# EAGLE schematic CONTROL circuit LED for Junction Box (EAGLE 9.6.2)
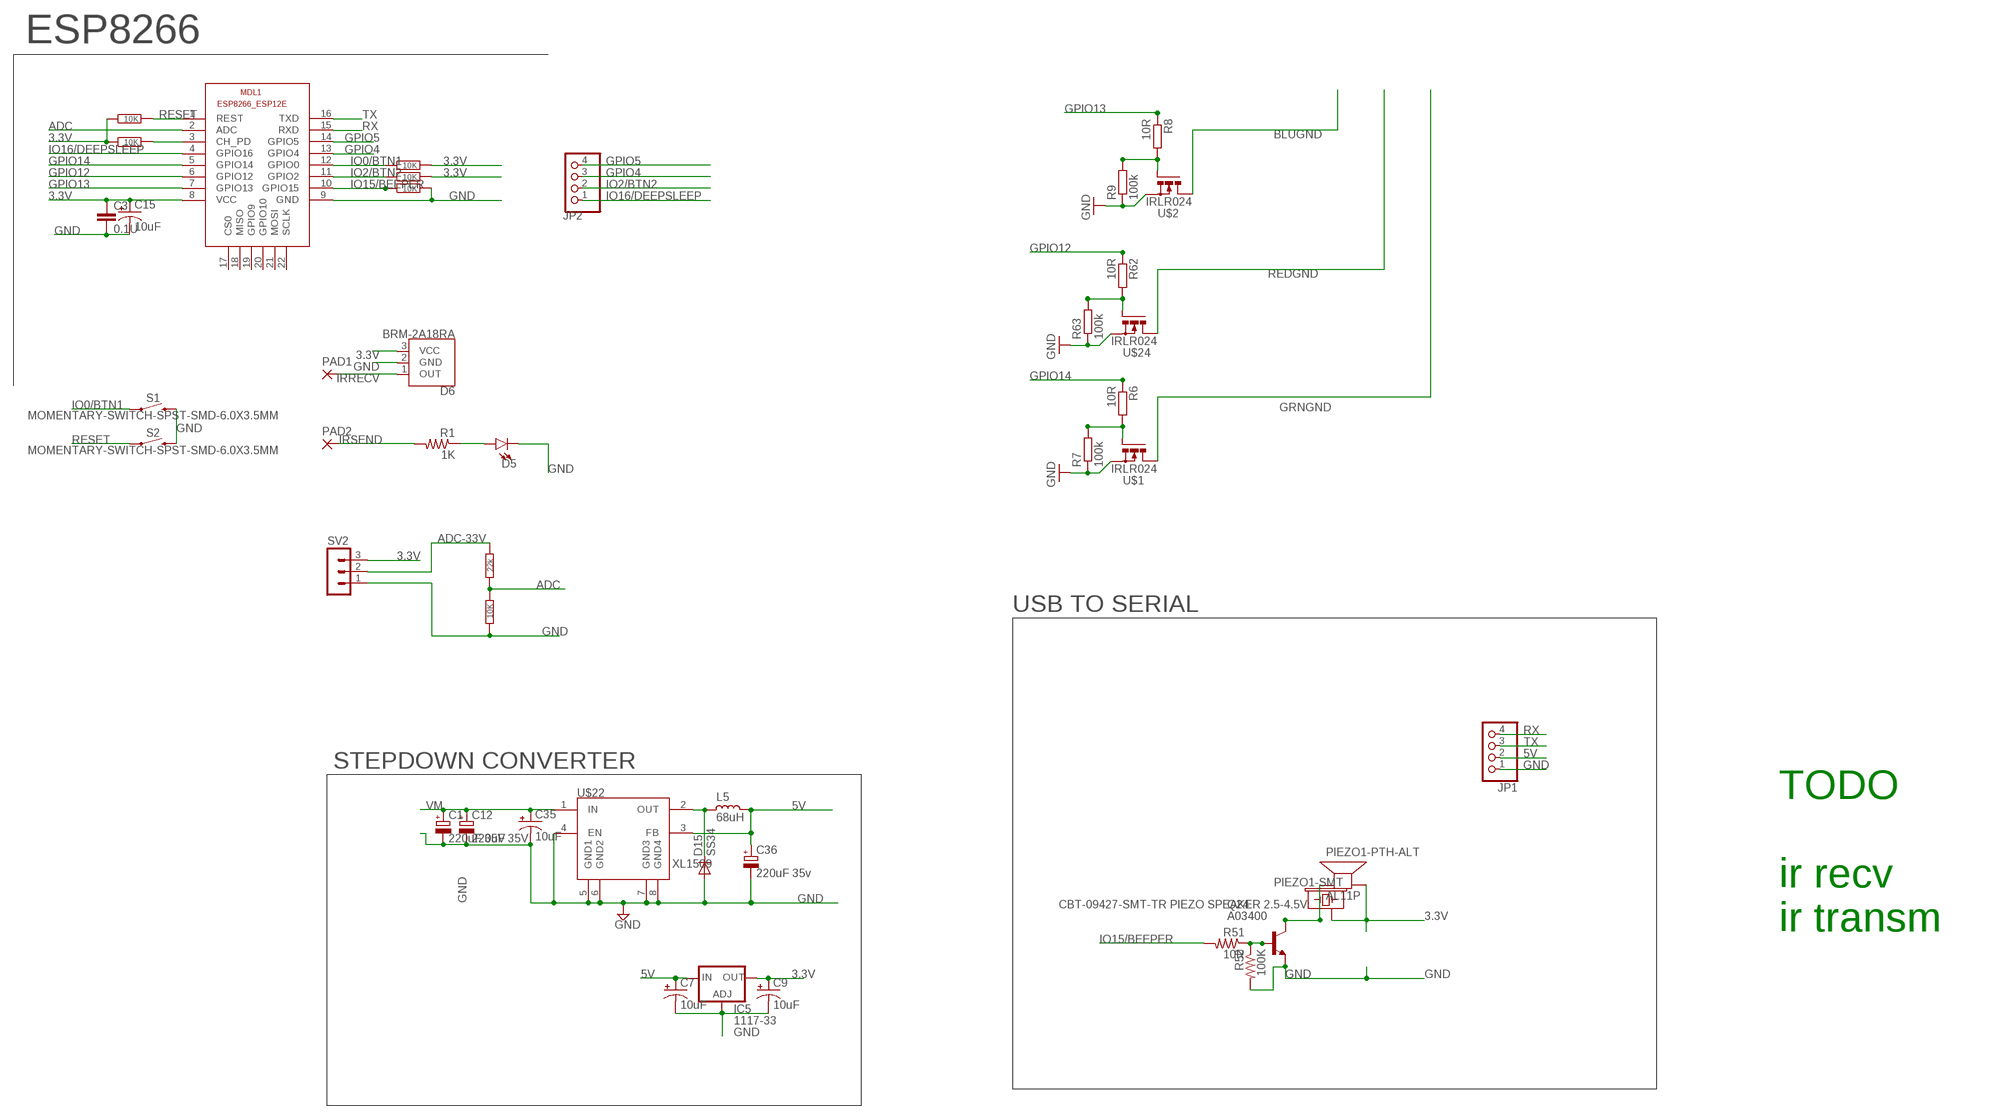
[diagram p0: schematic, sheet 1]

## Parts
C1  220uF 35V  CPOL-EUE3.5-8  [E3,5-8]
C3  0.1U  C-EUC1206  [C1206]
C7  10uF  CAP_POL1206  [EIA3216]
C9  10uF  CAP_POL1206  [EIA3216]
C12  220uF 35V  CPOL-EUE3.5-8  [E3,5-8]
C15  10uF  CAP_POL1206  [EIA3216]
C35  10uF  CAP_POL1206  [EIA3216]
C36  220uF 35v  CPOL-EUE3.5-8  [E3,5-8]
D5  LED3MM  [LED_3MM]
D6  BRM-2A18RA  [BRM-2508]
D15  SS34  DIODE-DO-214AC  [DO-214AC]
IC5  1117-33  LD117AS33TR  [SOT223]
JP1  PINHD-1X4  [1X04]
JP2  PINHD-1X4  [1X04]
L5  68uH  L_CD75  [CD75]
MDL1  ESP8266-12EESP8266-ESP12E  [ESP8266-ESP12E]
PAD1  1,6/0,9  [1,6/0,9]
PAD2  1,6/0,9  [1,6/0,9]
PIEZO1-PTH-ALT  AL11P  SPEAKER/AL11P  [AL11P]
PIEZO1-SMT  CBT-09427-SMT-TR PIEZO SPEAKER 2.5-4.5V  BUZZER-SMD  [BUZZER-CCV]
Q24  A03400  BC849SMD  [SOT23-BEC]
R1  1K  R-US_M1206  [M1206]
R3  22k  R-EU_R1206  [R1206]
R4  10K  R-EU_R1206  [R1206]
R6  10R  R-EU_R1206  [R1206]
R7  100k  R-EU_R1206  [R1206]
R8  10R  R-EU_R1206  [R1206]
R9  100k  R-EU_R1206  [R1206]
R11  10K  R-EU_R1206  [R1206]
R12  10K  R-EU_R1206  [R1206]
R28  10K  R-EU_R1206  [R1206]
R29  10K  R-EU_R1206  [R1206]
R31  10K  R-EU_R1206  [R1206]
R51  10R  R-US_R1206  [R1206]
R52  100K  R-US_R1206  [R1206]
R62  10R  R-EU_R1206  [R1206]
R63  100k  R-EU_R1206  [R1206]
S1  MOMENTARY-SWITCH-SPST-SMD-6.0X3.5MM  [TACTILE_SWITCH_SMD_6.0X3.5MM]
S2  MOMENTARY-SWITCH-SPST-SMD-6.0X3.5MM  [TACTILE_SWITCH_SMD_6.0X3.5MM]
SV2  MA03-1  [MA03-1]
U$1  IRLR024  N-POWER-MOSFETDPAK-MOSFET  [D-PAK_TO252AA]
U$2  IRLR024  N-POWER-MOSFETDPAK-MOSFET  [D-PAK_TO252AA]
U$22  XL1509  [SO08]
U$24  IRLR024  N-POWER-MOSFETDPAK-MOSFET  [D-PAK_TO252AA]

## Nets
3.3V: C3.1 C9.A(+) C15.A(+) D6.3(VCC) IC5.4(OUT) MDL1.8(VCC) PIEZO1-PTH-ALT.- PIEZO1-SMT.+ R11.2 R12.2 R28.1 R29.1 SV2.3
5V: C7.A(+) C36.+ IC5.3(IN) JP1.2 L5.1 U$22.3(FB)
ADC: MDL1.2(ADC) R3.1 R4.2
ADC-33V: R3.2 SV2.2
BEEPER-GND: PIEZO1-PTH-ALT.+ PIEZO1-SMT.- Q24.C
BLUGND: U$2.4(D)
GND: C1.- C3.2 C7.C(-) C9.C(-) C12.- C15.C(-) C35.C(-) C36.- D5.K(C) D6.2(GND) D15.2(A) IC5.1(ADJ) JP1.1 MDL1.9(GND) Q24.E R4.1 R7.1 R9.1 R31.2 R52.2 R63.1 S1.2 S2.2 SV2.1 U$1.3(S) U$2.3(S) U$22.4(EN) U$22.5(GND1) U$22.6(GND2) U$22.7(GND3) U$22.8(GND4) U$24.3(S)
GPIO4: JP2.3 MDL1.13(GPIO4)
GPIO5: JP2.4 MDL1.14(GPIO5)
GPIO12: MDL1.6(GPIO12) R62.1
GPIO13: MDL1.7(GPIO13) R8.1
GPIO14: MDL1.5(GPIO14) R6.1
GRNGND: U$1.4(D)
IO0/BTN1: MDL1.12(GPIO0) R12.1 S1.1
IO2/BTN2: JP2.2 MDL1.11(GPIO2) R11.1
IO15/BEEPER: MDL1.10(GPIO15) R31.1 R51.2
IO16/DEEPSLEEP: JP2.1 MDL1.4(GPIO16)
IRRECV: D6.1(OUT) PAD1.1(P)
IRSEND: PAD2.1(P) R1.2
N$3: R62.2 R63.2 U$24.1(G)
N$4: D15.1(C) L5.2 U$22.2(OUT)
N$5: R6.2 R7.2 U$1.1(G)
N$7: R8.2 R9.2 U$2.1(G)
N$13: D5.A R1.1
N$18: MDL1.3(CH_PD) R28.2
N$66: Q24.B R51.1 R52.1
REDGND: U$24.4(D)
RESET: MDL1.1(REST) R29.2 S2.1
RX: JP1.4 MDL1.15(RXD)
TX: JP1.3 MDL1.16(TXD)
VM: C1.+ C12.+ C35.A(+) U$22.1(IN)
Unconnected: MDL1.17(CS0) MDL1.18(MISO) MDL1.19(GPIO9) MDL1.20(GPIO10) MDL1.21(MOSI) MDL1.22(SCLK)

## Notes on the sheet
- ESP8266
- USB TO SERIAL
- STEPDOWN CONVERTER
- TODO
  
  ir recv
  ir transm

## Library data of the parts
C1 C12 C36 = rcl:CPOL-EU: POLARIZED CAPACITOR, European symbol
C3 = rcl:C-EU: CAPACITOR, European symbol
C7 C9 C15 C35 = SparkFun:CAP_POL: Capacitor Polarized These are standard SMD and PTH capacitors. Normally 10uF, 47uF, and 100uF in electrolytic and tantalum varieties. Always verify the external diameter of the through hole cap, it varies with capacity, voltage, and manufacturer. The EIA devices should be standard.
D5 = SparkFun-LED:LED: LED (Generic) Standard schematic elements and footprints for 5mm, 3mm, 1206, and 0603 sized LEDs. Generic LEDs with no color specified.; PROD_ID: DIO-08794
D6 = SparkFun-Sensors:BRM-2A18: BRM-2A18 IR Receiver The BRM-2A18 is miniaturized infrared receiver for remote control and other applications requiring improved ambient light rejection. Vertical package is a primary component on the ZX Distance and Gesture Sensor. RA package is not currently in-use. Example Datasheet <http://www.sinoskysun.com/upload/20110512/201105120447164615.PDF> SparkFun Products ZX Distance and Gesture Sensor <https://www.sparkfun.com/products/12780> (COM-12780)
D15 = dp_devices:DIODE: Various Diode Packages
IC5 = v-reg:LD117A?*: Low drop fixed and adjustable positive voltage regulators 1 A Source: http://www.st.com/stonline/products/literature/ds/7194/ld1117axx.pdf
JP1 JP2 = pinhead:PINHD-1X4: PIN HEADER
L5 = rc-master-smd:L_: INDUCTOR
MDL1 = ESP8266-ESP12E:ESP8266-12E: ESP8266-12E with additional I/O and GPIO04/05 corrected The author cannot warrant that this library is free from error or will meet your specific requirements. Created by PuceBaboon.com. Komagane, Nagano, JAPAN
PAD1 PAD2 = wirepad:1,6/0,9: THROUGH-HOLE PAD
PIEZO1-PTH-ALT = adafruit:SPEAKER: SPEAKER Source: Buerklin Added PS12 (for part # PS1240 piezo) http://www.ladyada.net/library/pcb/eaglelibrary.html
PIEZO1-SMT = SparkFun-Electromechanical:BUZZER: Buzzer Small round buzzers that operate around the audible 2kHz range. You can use these as speakers to create simple music or user interfaces. Variant Overview: PTH - Mini Speaker - PC Mount 12mm 2.048kHz <https://www.sparkfun.com/products/7950> PTH_KIT - Mini Speaker - PC Mount 12mm 2.048kHz <https://www.sparkfun.com/products/7950> KIT simplifies soldering by adding stop mask to one side of the pads. PTH_NO_SILK - Mini Speaker - PC Mount 12mm 2.048kHz <https://www.sparkfun.com/products/7950> No silkscreen indicator of buzzer outline. PTH_KIT_NO_SILK - Mini Speaker - PC Mount 12mm 2.048kHz <https://www.sparkfun.com/products/7950> KIT package w/o silkscreen SMD - Buzzer Audio Magnetic (CCV-084B16) SMD buzzer used on, e.g. the LilyPad Buzzer <https://www.sparkfun.com/products/8463> and RFID USB Reader <https://www.sparkfun.com/products/9963>. SMD_KIT - Buzzer Audio Magnetic (CCV-084B16) SMD Buzzer with elongated pins to make soldering easier. Used on the SparkFun Simon Says - Surface Mount Soldering Kit <https://www.sparkfun.com/products/10935>.; PROD_ID: COMP-08568
Q24 = transistor-npn:BC849*: NPN Transistor
R1 R51 R52 = adafruit:R-US_: RESISTOR, American symbol
R3 R4 R11 R12 R28 R29 R31 = rcl:R-EU_: RESISTOR, European symbol
R6-R9 R62 R63 = resistor:R-EU_: RESISTOR, European symbol
S1 S2 = SparkFun-Switches:MOMENTARY-SWITCH-SPST: Momentary Switch (Pushbutton) - SPST Normally-open (NO) SPST momentary switches (buttons, pushbuttons). Variants PTH-12MM - 12mm square, through-hole Momentary Pushbutton Switch - 12mm Square <https://www.sparkfun.com/products/9190> (COM-09190) PTH-6.0MM, PTH-6.0MM-KIT - 6.0mm square, through-hole Mini Pushbutton Switch <https://www.sparkfun.com/products/97> (COM-00097) KIT package intended for soldering kit's - only one side of pads' copper is exposed. PTH-RIGHT-ANGLE-KIT - Right-angle, through-hole Right Angle Tactile Button <https://www.sparkfun.com/products/10791> - Used on SparkFun BigTime Watch Kit <https://www.sparkfun.com/products/11734> SMD-12MM - 12mm square, surface-mount Tactile Button - SMD (12mm) <https://www.sparkfun.com/products/12993> (COM-12993) Used on SparkFun PicoBoard <https://www.sparkfun.com/products/11888> SMD-4.5MM - 4.5mm Square Trackball Switch Used on SparkFun Blackberry Trackballer Breakout <https://www.sparkfun.com/products/13169> SMD-4.6MMX2.8MM - 4.60mm x 2.80mm, surface mount Used on SparkFun SAMD21 Mini Breakout <https://www.sparkfun.com/products/13664> SMD-5.2MM, SMD-5.2-REDUNDANT - 5.2mm square, surface-mount Mini Pushbutton Switch - SMD <https://www.sparkfun.com/products/8720> (COM-08720) Used on Arduino Pro Mini <https://www.sparkfun.com/products/11114> REDUNDANT package connects both switch circuits together SMD-6.0X3.5MM - 6.0 x 3.5mm, surface mount Momentary Reset Switch SMD <https://www.sparkfun.com/products/8229> (COM-08229) SMD-6.2MM-TALL - 6.2mm square, surface mount Tactile Button - SMD (6mm) <https://www.sparkfun.com/products/12992> Used on SparkFun Digital Sandbox <https://www.sparkfun.com/products/12651> SMD-RIGHT-ANGLE - Right-angle, surface mount Used on SparkFun Block for Intel® Edison - Arduino <https://www.sparkfun.com/products/13036>; PROD_ID: SWCH-00815; SF_SKU: COM-08229
SV2 = con-lstb:MA03-1: PIN HEADER; OC_FARNELL: unknown; OC_NEWARK: unknown
U$1 U$2 U$24 = Cohesion_parts:N-POWER-MOSFET
U$22 = Cohesion_parts:XL1509